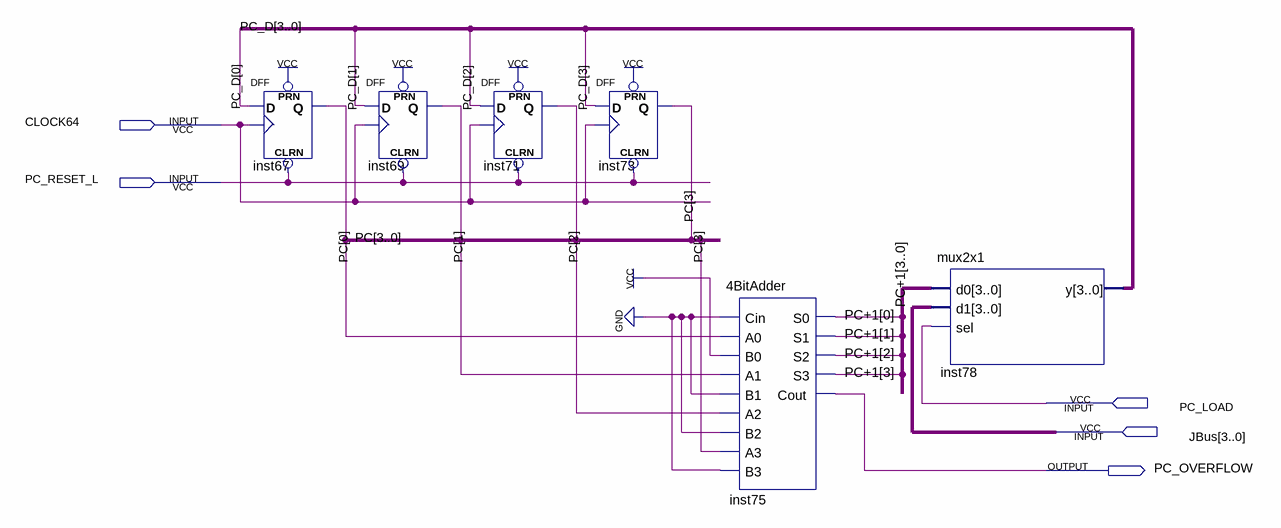
[diagram p0: schematic sheet]
// Quartus schematic 4Bit_PC.bdf as structural Verilog: 6 symbols, 5 pins
module \4Bit_PC  (
  input  CLOCK64,
  input  PC_RESET_L,
  input  PC_LOAD,
  input  [3:0] JBus,
  output PC_OVERFLOW
);

  wire [3:0] PC, \PC+1 , PC_D;

  DFF inst67 (.CLRN(PC_RESET_L), .CLK(CLOCK64), .D(PC_D[0]), .PRN(1'b1), .Q(PC[0]));
  DFF inst69 (.CLRN(PC_RESET_L), .CLK(CLOCK64), .D(PC_D[1]), .PRN(1'b1), .Q(PC[1]));
  DFF inst71 (.CLRN(PC_RESET_L), .CLK(CLOCK64), .D(PC_D[2]), .PRN(1'b1), .Q(PC[2]));
  DFF inst73 (.CLRN(PC_RESET_L), .CLK(CLOCK64), .D(PC_D[3]), .PRN(1'b1), .Q(PC[3]));
  \4BitAdder  inst75 (
    .Cin(1'b0), .A0(PC[0]), .B0(1'b1), .A1(PC[1]), .B1(1'b0), .A2(PC[2]), .B2(1'b0), .A3(PC[3]), .B3(1'b0),
    .S0(\PC+1 [0]), .S1(\PC+1 [1]), .S2(\PC+1 [2]), .S3(\PC+1 [3]), .Cout(PC_OVERFLOW));
  mux2x1 inst78 (.d0(\PC+1 ), .d1(JBus), .sel(PC_LOAD), .y(PC_D));
endmodule
